# Altium schematic sheet Test jig master.SchDoc
size A4
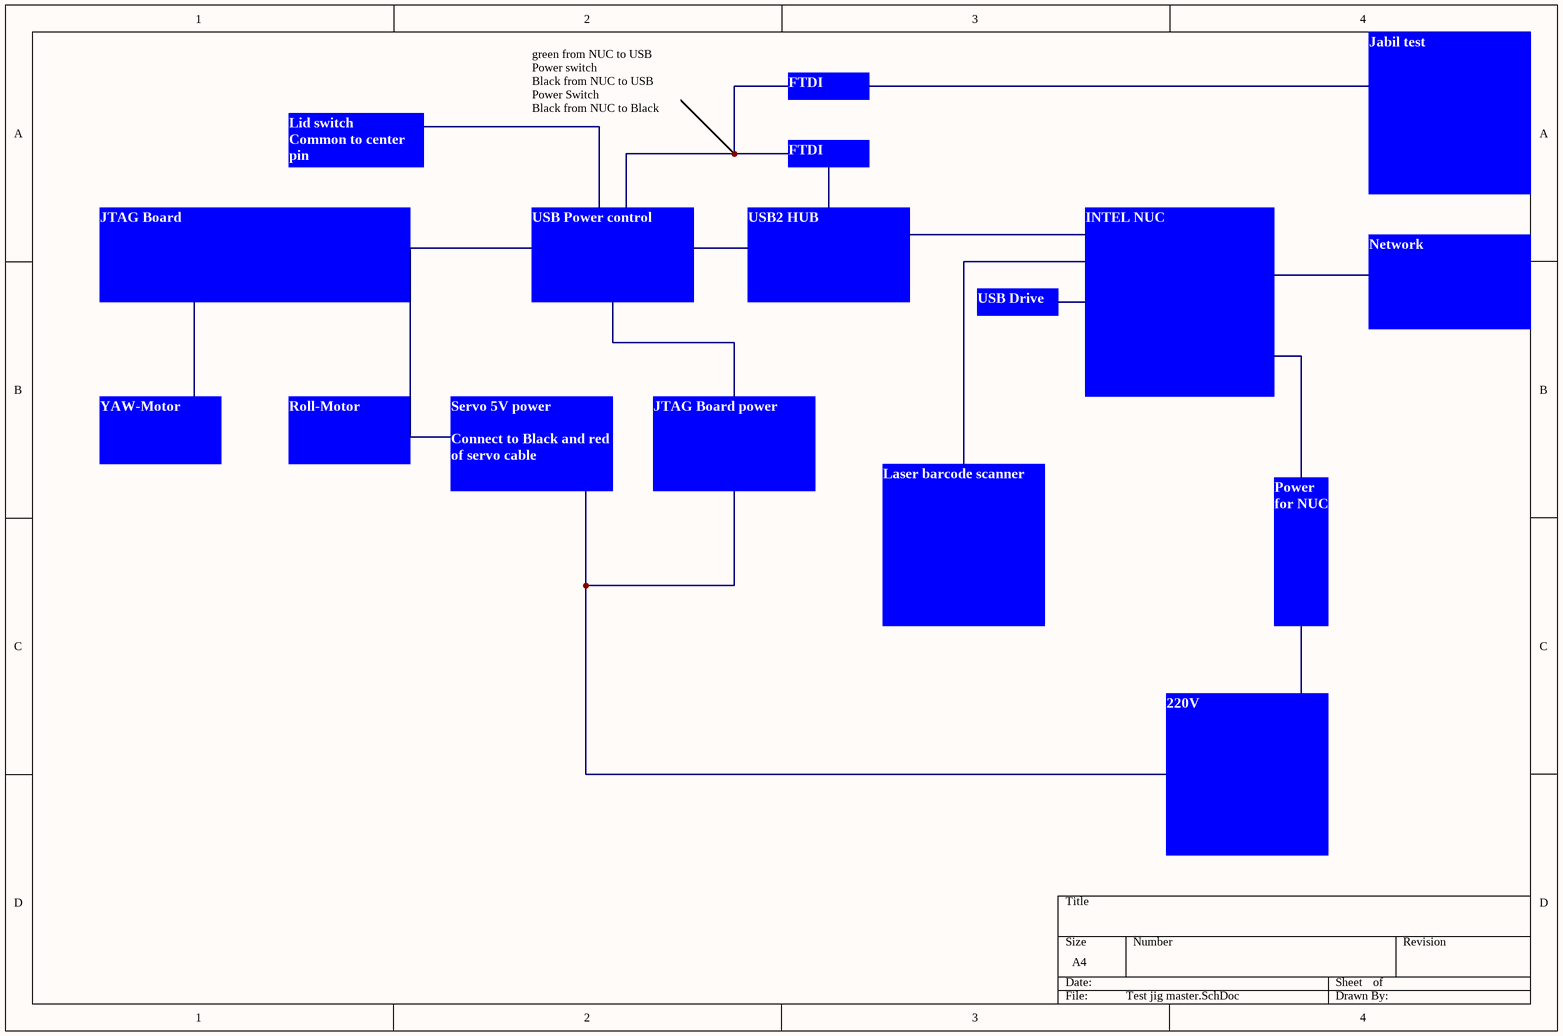
[diagram p0: Test jig master.SchDoc]

## Notes on the sheet
- green from NUC to USB Power switch
  Black from NUC to USB Power Switch
  Black from NUC to Black from Jabil test
  Orange from NUC to Yellow from Jabil test
  Yellow from NUC to Orange from Jabil test
- FTDI
- Lid switch
  Common to center pin
- Jabil test
- JTAG Board
- USB Power control
- USB2 HUB
- USB Drive
- Network
- INTEL NUC
- YAW-Motor
- Roll-Motor
- Servo 5V power
  Connect to Black and red of servo cable
- JTAG Board power
- Laser barcode scanner
- Power for NUC
- 220V